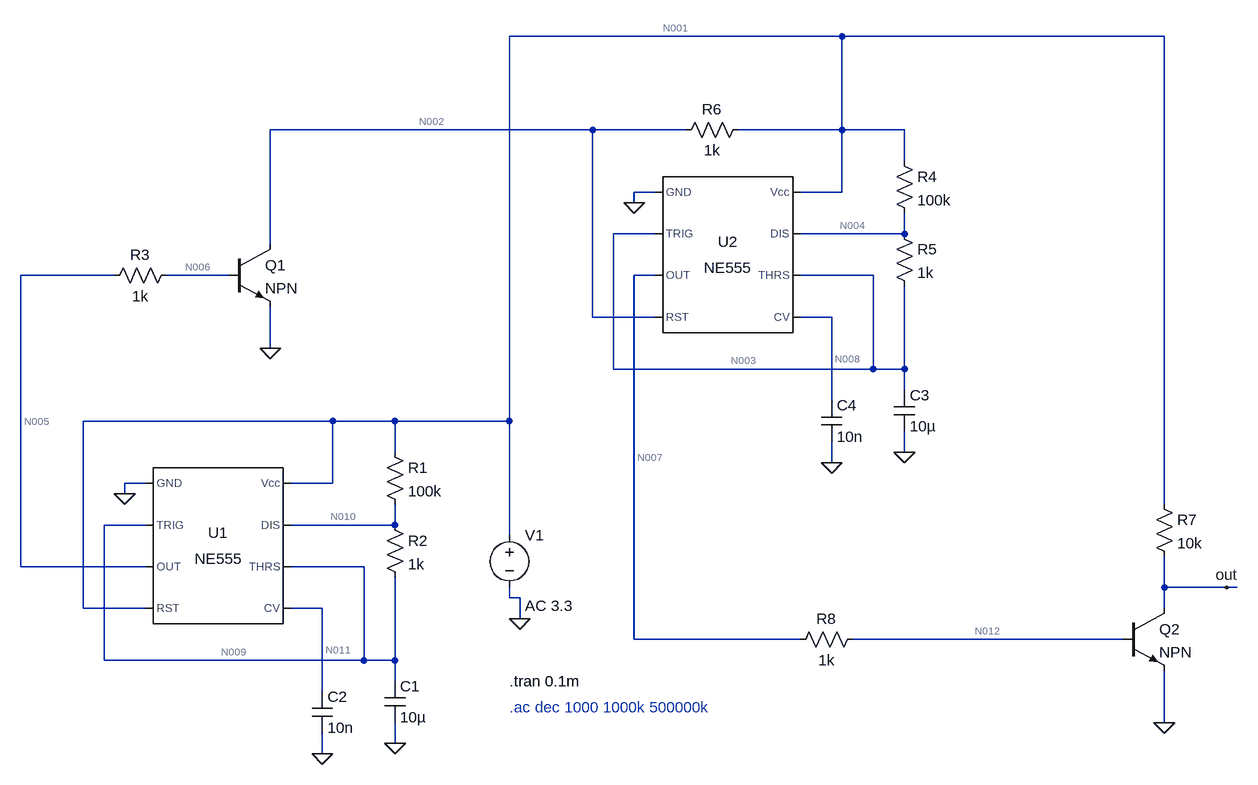
[diagram p0: schematic Draft2.asc]
Draft2.asc, the LTspice schematic file:
Version 4.1
SHEET 1 1812 680
WIRE 1184 -624 672 -624
WIRE 1680 -624 1184 -624
WIRE 800 -480 304 -480
WIRE 944 -480 800 -480
WIRE 1184 -480 1184 -624
WIRE 1184 -480 1024 -480
WIRE 1280 -480 1184 -480
WIRE 1280 -432 1280 -480
WIRE 896 -384 864 -384
WIRE 1184 -384 1184 -480
WIRE 1184 -384 1120 -384
WIRE 864 -368 864 -384
WIRE 896 -320 832 -320
WIRE 1280 -320 1280 -352
WIRE 1280 -320 1120 -320
WIRE 304 -304 304 -480
WIRE 64 -256 -80 -256
WIRE 240 -256 144 -256
WIRE 896 -256 864 -256
WIRE 1232 -256 1120 -256
WIRE 800 -192 800 -480
WIRE 896 -192 800 -192
WIRE 1168 -192 1120 -192
WIRE 304 -144 304 -208
WIRE 832 -112 832 -320
WIRE 1232 -112 1232 -256
WIRE 1232 -112 832 -112
WIRE 1280 -112 1280 -240
WIRE 1280 -112 1232 -112
WIRE 1280 -80 1280 -112
WIRE 1168 -64 1168 -192
WIRE 400 -32 16 -32
WIRE 496 -32 400 -32
WIRE 672 -32 672 -624
WIRE 672 -32 496 -32
WIRE 496 16 496 -32
WIRE 1280 16 1280 -16
WIRE 1168 32 1168 0
WIRE 112 64 80 64
WIRE 400 64 400 -32
WIRE 400 64 336 64
WIRE 80 80 80 64
WIRE 1680 96 1680 -624
WIRE 112 128 48 128
WIRE 496 128 496 96
WIRE 496 128 336 128
WIRE 672 144 672 -32
WIRE -80 192 -80 -256
WIRE 112 192 -80 192
WIRE 448 192 336 192
WIRE 1680 224 1680 176
WIRE 1776 224 1680 224
WIRE 1792 224 1776 224
WIRE 672 240 672 224
WIRE 688 240 672 240
WIRE 16 256 16 -32
WIRE 112 256 16 256
WIRE 384 256 336 256
WIRE 1680 256 1680 224
WIRE 688 272 688 240
WIRE 864 304 864 -256
WIRE 1120 304 864 304
WIRE 1616 304 1200 304
WIRE 48 336 48 128
WIRE 448 336 448 192
WIRE 448 336 48 336
WIRE 496 336 496 208
WIRE 496 336 448 336
WIRE 496 368 496 336
WIRE 384 384 384 256
WIRE 1680 432 1680 352
WIRE 496 464 496 432
WIRE 384 480 384 448
FLAG 496 464 0
FLAG 384 480 0
FLAG 80 80 0
FLAG 688 272 0
FLAG 1280 16 0
FLAG 1168 32 0
FLAG 864 -368 0
FLAG 304 -144 0
FLAG 1680 432 0
FLAG 1776 224 out
SYMBOL Misc\\NE555 224 160 R0
SYMATTR InstName U1
SYMBOL res 480 0 R0
SYMATTR InstName R1
SYMATTR Value 100k
SYMBOL res 480 112 R0
SYMATTR InstName R2
SYMATTR Value 1k
SYMBOL res 160 -272 R90
WINDOW 0 0 56 VBottom 2
WINDOW 3 32 56 VTop 2
SYMATTR InstName R3
SYMATTR Value 1k
SYMBOL cap 480 368 R0
SYMATTR InstName C1
SYMATTR Value 10µ
SYMBOL cap 368 384 R0
SYMATTR InstName C2
SYMATTR Value 10n
SYMBOL voltage 672 128 R0
WINDOW 3 24 96 Invisible 2
WINDOW 123 24 124 Left 2
WINDOW 39 0 0 Left 0
SYMATTR InstName V1
SYMATTR Value 3.3
SYMATTR Value2 AC 3.3
SYMBOL npn 240 -304 R0
SYMATTR InstName Q1
SYMBOL Misc\\NE555 1008 -288 R0
SYMATTR InstName U2
SYMBOL res 1264 -448 R0
SYMATTR InstName R4
SYMATTR Value 100k
SYMBOL res 1264 -336 R0
SYMATTR InstName R5
SYMATTR Value 1k
SYMBOL cap 1264 -80 R0
SYMATTR InstName C3
SYMATTR Value 10µ
SYMBOL cap 1152 -64 R0
SYMATTR InstName C4
SYMATTR Value 10n
SYMBOL res 1040 -496 R90
WINDOW 0 0 56 VBottom 2
WINDOW 3 32 56 VTop 2
SYMATTR InstName R6
SYMATTR Value 1k
SYMBOL npn 1616 256 R0
SYMATTR InstName Q2
SYMBOL res 1104 320 R270
WINDOW 0 32 56 VTop 2
WINDOW 3 0 56 VBottom 2
SYMATTR InstName R8
SYMATTR Value 1k
SYMBOL res 1664 80 R0
SYMATTR InstName R7
SYMATTR Value 10k
TEXT 672 368 Left 2 !.tran 0.1m
TEXT 672 408 Left 2 ;.ac dec 1000 1000k 500000k

The netlist it stands for:
* Draft2.asc
X§U1 0 N009 N005 N001 N011 N009 N010 N001 NE555  ; pins GND TRIG OUT RST CV THRS DIS Vcc
R1 N001 N010 100k
R2 N010 N009 1k
R3 N006 N005 1k
C1 N009 0 10µ
C2 N011 0 10n
V1 N001 0 3.3 AC 3.3
Q1 N002 N006 0 0 NPN
X§U2 0 N003 N007 N002 N008 N003 N004 N001 NE555  ; pins GND TRIG OUT RST CV THRS DIS Vcc
R4 N001 N004 100k
R5 N004 N003 1k
C3 N003 0 10µ
C4 N008 0 10n
R6 N001 N002 1k
Q2 out N012 0 0 NPN
R8 N007 N012 1k
R7 N001 out 10k
.model NPN NPN
.model PNP PNP
.lib standard.bjt
.tran 0.1m
* .ac dec 1000 1000k 500000k
.lib NE555.sub
.backanno
.end

* Results of the author's LTspice run, read from the files saved beside the schematic
* Operating Point, zero values left out:
*   V(n005) = 3.285 V
*   V(n011) = 2.2 V
*   V(n010) = 3.299 V
*   V(n002) = 32.74 mV
*   V(n008) = 2.2 V
*   V(out) = 3.3 V
*   V(n012) = 19.8 µV
*   V(n009) = 3.299 V
*   V(n001) = 3.3 V
*   V(n006) = 829.3 mV
*   V(n003) = 198 µV
*   V(n007) = 19.8 µV
*   V(n004) = 198 µV
*   I(R3) = -2.456 mA
*   I(V1) = -8.264 mA
*   I(R6) = 3.267 mA
*   I(R8) = -3.3 pA
*   I(R1) = 11 nA
*   I(R2) = 6.598 nA
*   Ic(Q1) = 3.667 mA
*   Ib(Q1) = 2.456 mA
*   Ie(Q1) = -6.123 mA
*   I(R4) = 33 µA
*   Ic(Q2) = 3.3 pA
*   Ib(Q2) = -3.3 pA
*   I(R7) = 3.3 pA
*   Ix(u2:1) = -1.081 mA
*   Ix(u2:3) = 3.3 pA
*   Ix(u2:4) = -400 µA
*   Ix(u2:7) = 33 µA
*   Ix(u2:8) = 1.448 mA
*   Ix(u1:1) = -1.06 mA
*   Ix(u1:2) = 3.299 nA
*   Ix(u1:3) = -2.456 mA
*   Ix(u1:4) = 11.33 µA
*   Ix(u1:6) = 3.299 nA
*   Ix(u1:7) = 4.402 nA
*   Ix(u1:8) = 3.504 mA
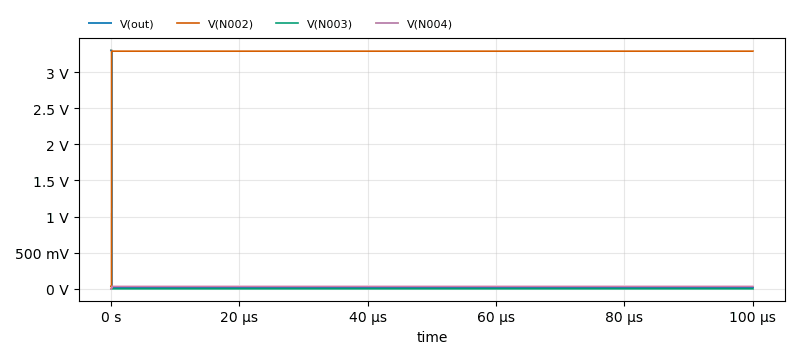
[diagram p1: Transient Analysis of Draft2.asc, plotted from the saved traces]
* Transient Analysis, 1 run:
*   V(out): min 19.63 mV, max 3.3 V, average 25.32 mV, rms 138.8 mV, last 19.63 mV
*   V(N002): min 32.74 mV, max 3.289 V, average 3.285 V, rms 3.287 V, last 3.289 V
*   V(N003): min 198 µV, max 524.2 µV, average 360.9 µV, rms 392.9 µV, last 524.2 µV
*   V(N004): min 198 µV, max 33.19 mV, average 32.98 mV, rms 33.01 mV, last 33.19 mV